# Altium schematic sheet temperature-sensor.SchDoc
size 297 x 209 mm
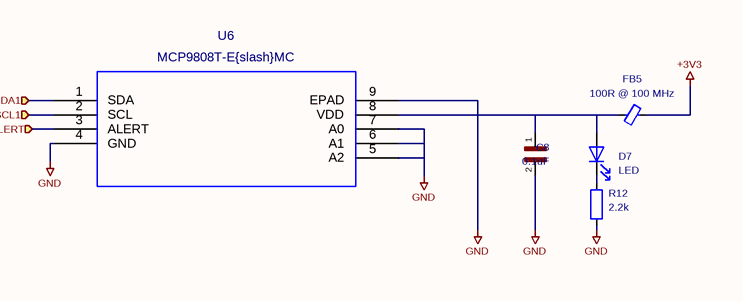
[diagram p0: temperature-sensor.SchDoc]

## Parts
C8  0.1uF  [C_0603_1608Metric]
D7  LED  [LED_0603_1608Metric]
FB5  100R @ 100 MHz  [L_0603_1608Metric]
R12  2.2k  [R_0603_1608Metric]
U6  MCP9808T-E{slash}MC  [MCP9808T-E&slash_MC]

## Ports
GPIO_TEMP_ALERT (in), I2C_SCL1 (in), I2C_SDA1 (in)

## Nets
+3V3: FB5.1
GND: C8.2 R12.2 U6.4(GND) U6.5(A2) U6.6(A1) U6.7(A0) U6.9(EPAD)
GPIO_TEMP_ALERT: U6.3(ALERT) ; port GPIO_TEMP_ALERT
I2C_SCL1: U6.2(SCL) ; port I2C_SCL1
I2C_SDA1: U6.1(SDA) ; port I2C_SDA1
NetC8_1: C8.1 D7.2(A) FB5.2 U6.8(VDD)
NetD7_1: D7.1(K) R12.1

## Notes on the sheet
- 1
- 2
- 3
- 4
- 5
- 6
- A
- B
- C
- D
- Title:
- File: temperature-sensor.kicad_sch
- Sheet: /
- KiCad E.D.A.  kicad (5.1.4)-1
- Size: A4
- Date:
- Rev:
- Id: 1/1

## Library data of the parts
C8 = CL10B104KB8NNNL: Value: 0.1uF; Footprint: Capacitor_SMD:C_0603_1608Metric
FB5 = FerriteBead_Small: Value: 100R @ 100 MHz; Footprint: Inductor_SMD:L_0603_1608Metric
R12 = R: Value: 2.2k; Footprint: Resistor_SMD:R_0603_1608Metric
U6 = MCP9808T-E{brace}slash}MC: Value: MCP9808T-E{slash}MC; Footprint: qset-footprints:MCP9808T-E&slash_MC
D7 = LED: Value: LED; Footprint: LED_SMD:LED_0603_1608Metric